# Altium project ESP32_USB_C.PrjPcb (part 2 of 3)
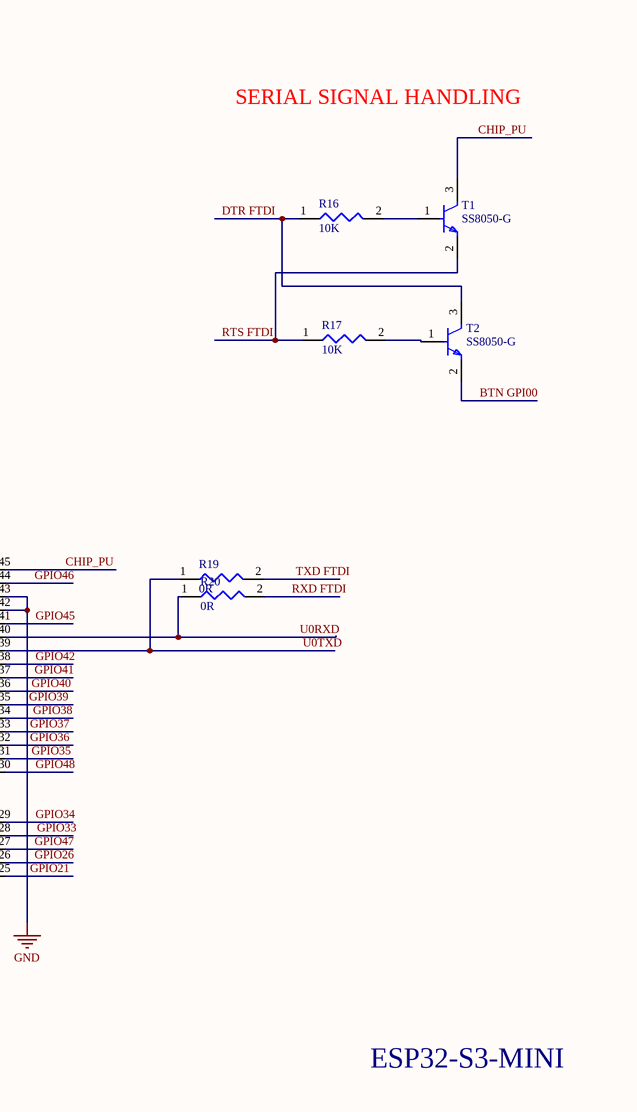
[diagram p4: ESP32_USB_C.SchDoc, bottom right]

## Sheet ESP32_USB_C.SchDoc (continued)
### Library data of the parts
C1 C8 = CC0402MRX5R6BB475: 10V 4.7uF X5R ±20% 0402 Multilayer Ceramic Capacitors MLCC - SMD/SMT ROHS; Manufacturer: Yageo Group; Value: 4.7µF; Temperature Coefficient: 30ppm/°C; Supplier: DigiKey; Supplier Part Number: 311-1734-1-ND; Manufacturer Part Number: CC0402MRX5R6BB475; RoHS: Compliant; Category: Ceramic Capacitors; Stock: 3327; Pricing: 1=0.1, 10=0.055, 50=0.038, 100=0.0328, 500=0.02396, 1000=0.02127, 2500=0.01843, 5000=0.01673 (USD); Case/Package: 0402; Case Code (Imperial): 0402; Case Code (Metric): 1005; China RoHS: Compliant; Country of Origin: Mainland China, Taiwan; Dielectric: X5R; Dielectric Material: Ceramic; Export Control Classification Number (ECCN) Code: EAR99; Halogen Free: Halogen Free; Height: 500µm; Harmonized Tariff Schedule (HTS) Code: 8532.24.00.20; Introduction Date: 2014-07-08; Lead Free: Lead Free; Length: 1mm; Lifecycle Status: Production; Material: Ceramic; Max Operating Temperature: 85°C; Min Operating Temperature: -55°C; Mounting Technology: Surface Mount; Number of Terminals: 2; Packaging: Tape & Reel (TR); REACH SVHC: Yes; Termination: SMD/SMT; Thickness: 558.8µm; Tolerance: 20%; Voltage Rating: 10V; Voltage Rating (DC): 10V; Weight: 652.039032µg; Width: 500µm; ComponentLink1URL: https://datasheet.octopart.com:443/CC0402MRX5R6BB475-Yageo-datasheet-170350636.pdf?src-supplier=IHS; ComponentLink1Description: https://datasheet.octopart.com:443/CC0402MRX5R6BB475-Yageo-datasheet-170350636.pdf?src-supplier=IHS; ComponentLink2URL: https://datasheet.octopart.com:443/CC0402MRX5R6BB475-Yageo-datasheet-78855684.pdf?src-supplier=Upverter; ComponentLink2Description: https://datasheet.octopart.com:443/CC0402MRX5R6BB475-Yageo-datasheet-78855684.pdf?src-supplier=Upverter; ComponentLink3URL: https://datasheet.octopart.com:443/CC0402MRX5R6BB475-Yageo-datasheet-140260304.pdf?src-supplier=Newark; ComponentLink3Description: https://datasheet.octopart.com:443/CC0402MRX5R6BB475-Yageo-datasheet-140260304.pdf?src-supplier=Newark; ComponentLink4URL: https://datasheet.octopart.com:443/CC0402MRX5R6BB475-Yageo-Group-datasheet-175963154.pdf?src-supplier=Newark; ComponentLink4Description: https://datasheet.octopart.com:443/CC0402MRX5R6BB475-Yageo-Group-datasheet-175963154.pdf?src-supplier=Newark; ComponentLink5URL: https://datasheet.octopart.com:443/CC0402MRX5R6BB475-Yageo-datasheet-158238148.pdf?src-supplier=Newark; ComponentLink5Description: https://datasheet.octopart.com:443/CC0402MRX5R6BB475-Yageo-datasheet-158238148.pdf?src-supplier=Newark; ComponentLink6URL: https://datasheet.octopart.com:443/CC0402MRX5R6BB475-Yageo-datasheet-182029487.pdf?src-supplier=Farnell; ComponentLink6Description: https://datasheet.octopart.com:443/CC0402MRX5R6BB475-Yageo-datasheet-182029487.pdf?src-supplier=Farnell; ComponentLink7URL: https://datasheet.octopart.com/CC0402MRX5R6BB475-Yageo-datasheet-86397281.pdf; ComponentLink7Description: https://datasheet.octopart.com/CC0402MRX5R6BB475-Yageo-datasheet-86397281.pdf; ComponentLink8URL: https://datasheet.octopart.com:443/CC0402MRX5R6BB475-Yageo-Group-datasheet-189192896.pdf?src-supplier=TME; ComponentLink8Description: https://datasheet.octopart.com:443/CC0402MRX5R6BB475-Yageo-Group-datasheet-189192896.pdf?src-supplier=TME; ComponentLink9URL: https://datasheet.octopart.com:443/CC0402MRX5R6BB475-Yageo-Group-datasheet-145016144.pdf?src-supplier=ODG+(Origin+Data+Global); ComponentLink9Description: https://datasheet.octopart.com:443/CC0402MRX5R6BB475-Yageo-Group-datasheet-145016144.pdf?src-supplier=ODG+(Origin+Data+Global); ComponentLink10URL: https://datasheet.octopart.com:443/CC0402MRX5R6BB475-Yageo-datasheet-137700085.pdf?src-supplier=Future+Electronics; ComponentLink10Description: https://datasheet.octopart.com:443/CC0402MRX5R6BB475-Yageo-datasheet-137700085.pdf?src-supplier=Future+Electronics; ComponentLink11URL: https://datasheet.octopart.com:443/CC0402MRX5R6BB475-Yageo-datasheet-78855687.pdf?src-supplier=Future+Electronics; ComponentLink11Description: https://datasheet.octopart.com:443/CC0402MRX5R6BB475-Yageo-datasheet-78855687.pdf?src-supplier=Future+Electronics; ComponentLink12URL: http://sigma.octopart.com:80/conflict_mineral_statement/Yageo-company-3.pdf?src-supplier=Compliance+Statements; ComponentLink12Description: http://sigma.octopart.com:80/conflict_mineral_statement/Yageo-company-3.pdf?src-supplier=Compliance+Statements; ComponentLink13URL: http://sigma.octopart.com:80/rohs_statement/Yageo-company-2.pdf?src-supplier=Compliance+Statements; ComponentLink13Description: http://sigma.octopart.com:80/rohs_statement/Yageo-company-2.pdf?src-supplier=Compliance+Statements
C2-C7 C12 = CL10E104KC8VPNC: Ceramic Capacitor, Multilayer, Ceramic, 100V, 10% +Tol, 10% -Tol, X8L, -40~+15% TC, 100nF, Surface Mount, 0603 inch; Manufacturer: Samsung Electro-Mechanics; Supplier: DigiKey; Supplier Part Number: 1276-CL10E104KC8VPNCDKR-ND; Manufacturer Part Number: CL10E104KC8VPNC; RoHS: Compliant; Category: Ceramic Capacitors; Stock: 438805; Pricing: 1=0.27, 10=0.155, 50=0.1122, 100=0.0989, 500=0.07654, 1000=0.06965 (USD); Value: 100nF; Case/Package: 0603; Dielectric Material: Ceramic; Height: 800µm; Length: 1.6mm; Lifecycle Status: Production; Max Operating Temperature: 150°C; Min Operating Temperature: -55°C; Mounting Technology: Surface Mount; Number of Terminals: 2; Ratings: AEC-Q200; REACH SVHC: Yes; Voltage Rating (DC): 100V; Width: 800µm
C9 = AC0612MRX7R9BB103: Surface Mount Ceramic Multilayer Capacitor Automotive Grade 0.01uF 20% X7R 50V 0612 Paper T/R; Manufacturer: Yageo Group; Value: 10nF; Number of Circuits: 4; Number of Elements: 1; Temperature Coefficient: 30ppm/°C; Supplier: DigiKey; Supplier Part Number: 13-AC0612MRX7R9BB103CT-ND; Manufacturer Part Number: AC0612MRX7R9BB103; RoHS: Compliant; Category: Capacitor Arrays; Stock: 4000; Pricing: 1=0.45, 10=0.272, 50=0.2022, 100=0.1808, 500=0.14454, 1000=0.13334 (USD); Case/Package: 0612; China RoHS: Non-Compliant; Country of Origin: Mainland China, Taiwan; Dielectric: X7R; Dielectric Material: Ceramic; Export Control Classification Number (ECCN) Code: EAR99; Height: 800µm; Height - Seated (Max): 800µm; Harmonized Tariff Schedule (HTS) Code: 8532.25.00.45; Introduction Date: 2017-01-16; Length: 3.2mm; Lifecycle Status: Production; Material: Ceramic; Max Operating Temperature: 125°C; Min Operating Temperature: -55°C; Mounting Technology: Surface Mount; Number of Terminals: 8; Ratings: AEC-Q200; REACH SVHC: Yes; Terminal Pitch: 800µm; Tolerance: 20%; Voltage Rating: 50V; Voltage Rating (DC): 50V; Width: 1.6mm; ComponentLink1URL: https://datasheet.octopart.com:443/AC0612MRX7R9BB103-Yageo-datasheet-170350635.pdf?src-supplier=IHS; ComponentLink1Description: https://datasheet.octopart.com:443/AC0612MRX7R9BB103-Yageo-datasheet-170350635.pdf?src-supplier=IHS; ComponentLink2URL: https://datasheet.octopart.com:443/AC0612MRX7R9BB103-Yageo-datasheet-130008987.pdf?src-supplier=Upverter; ComponentLink2Description: https://datasheet.octopart.com:443/AC0612MRX7R9BB103-Yageo-datasheet-130008987.pdf?src-supplier=Upverter; ComponentLink3URL: https://datasheet.octopart.com:443/AC0612MRX7R9BB103-Yageo-datasheet-182878021.pdf?src-supplier=Farnell; ComponentLink3Description: https://datasheet.octopart.com:443/AC0612MRX7R9BB103-Yageo-datasheet-182878021.pdf?src-supplier=Farnell; ComponentLink4URL: http://sigma.octopart.com:80/conflict_mineral_statement/Yageo-company-3.pdf?src-supplier=Compliance+Statements; ComponentLink4Description: http://sigma.octopart.com:80/conflict_mineral_statement/Yageo-company-3.pdf?src-supplier=Compliance+Statements; ComponentLink5URL: http://sigma.octopart.com:80/rohs_statement/Yageo-company-2.pdf?src-supplier=Compliance+Statements; ComponentLink5Description: http://sigma.octopart.com:80/rohs_statement/Yageo-company-2.pdf?src-supplier=Compliance+Statements
C10 = C0805C106K9RACTU: SMD Comm X7R 0805 (2012Metric) Ceramic Capacitor 0.079Lx0.049W 2.00mmx1.25mm X7R ±10% 10muF; Manufacturer: Yageo Group; Value: 10µF; Dissipation Factor: 7.5%; Voltage Rating: 6.3V; Supplier: DigiKey; Supplier Part Number: 399-C0805C106K9RACTUDKR-ND; Manufacturer Part Number: C0805C106K9RACTU; RoHS: Compliant; Category: Ceramic Capacitors; Stock: 33258; Pricing: 1=0.67, 10=0.417, 50=0.3166, 100=0.2858, 500=0.23376, 1000=0.21768 (USD); Case/Package: 0805; Case Code (Imperial): 0805; Case Code (Metric): 2012; China RoHS: Compliant; Country of Origin: Mexico; Depth: 1.25mm; Dielectric: X7R; Dielectric Material: Ceramic; Export Control Classification Number (ECCN) Code: EAR99; Height: 1.25mm; Harmonized Tariff Schedule (HTS) Code: 8532.24.00.20; Introduction Date: 2012-05-22; Length: 2mm; Lifecycle Status: Production; Material: Ceramic; Max Operating Temperature: 125°C; Manufacturer Package Identifier: 0805 (2012 metric); Min Operating Temperature: -55°C; Mounting Technology: Surface Mount; Number of Terminals: 2; Packaging: Cut Tape; REACH SVHC: Yes; Schedule B: 8532240020, 8532240020|8532240020|8532240020|8532240020|8532240020; Termination: SMD/SMT; Thickness: 1.397mm; Tolerance: 10%; Voltage Rating (DC): 6.3V; Width: 1.25mm; ComponentLink1URL: https://datasheet.octopart.com:443/C0805C106K9RACTU-KEMET-datasheet-178445679.pdf?src-supplier=IHS; ComponentLink1Description: https://datasheet.octopart.com:443/C0805C106K9RACTU-KEMET-datasheet-178445679.pdf?src-supplier=IHS; ComponentLink2URL: https://datasheet.octopart.com:443/C0805C106K9RAC7800-KEMET-datasheet-184793276.pdf?src-supplier=IHS; ComponentLink2Description: https://datasheet.octopart.com:443/C0805C106K9RAC7800-KEMET-datasheet-184793276.pdf?src-supplier=IHS; ComponentLink3URL: https://datasheet.octopart.com:443/C0805C106K9RACTU-KEMET-datasheet-137357759.pdf?src-supplier=Farnell; ComponentLink3Description: https://datasheet.octopart.com:443/C0805C106K9RACTU-KEMET-datasheet-137357759.pdf?src-supplier=Farnell; ComponentLink4URL: https://datasheet.octopart.com:443/C0805C106K9RACTU-KEMET-datasheet-100448665.pdf?src-supplier=Farnell; ComponentLink4Description: https://datasheet.octopart.com:443/C0805C106K9RACTU-KEMET-datasheet-100448665.pdf?src-supplier=Farnell; ComponentLink5URL: https://datasheet.octopart.com:443/C0805C106K9RACTU-KEMET-datasheet-74831648.pdf?src-supplier=Farnell; ComponentLink5Description: https://datasheet.octopart.com:443/C0805C106K9RACTU-KEMET-datasheet-74831648.pdf?src-supplier=Farnell; ComponentLink6URL: https://datasheet.octopart.com:443/C0805C106K9RACTU-Kemet-datasheet-66076756.pdf?src-supplier=element14+APAC; ComponentLink6Description: https://datasheet.octopart.com:443/C0805C106K9RACTU-Kemet-datasheet-66076756.pdf?src-supplier=element14+APAC; ComponentLink7URL: https://datasheet.octopart.com:443/C0805C106K9RACTU-Kemet-datasheet-62058920.pdf?src-supplier=element14+APAC; ComponentLink7Description: https://datasheet.octopart.com:443/C0805C106K9RACTU-Kemet-datasheet-62058920.pdf?src-supplier=element14+APAC; ComponentLink8URL: https://datasheet.octopart.com:443/C0805C106K9RACTU-KEMET-datasheet-68331906.pdf?src-supplier=element14+APAC; ComponentLink8Description: https://datasheet.octopart.com:443/C0805C106K9RACTU-KEMET-datasheet-68331906.pdf?src-supplier=element14+APAC; ComponentLink9URL: https://datasheet.octopart.com:443/C0805C106K9RACTU-KEMET-datasheet-176289605.pdf?src-supplier=Newark; ComponentLink9Description: https://datasheet.octopart.com:443/C0805C106K9RACTU-KEMET-datasheet-176289605.pdf?src-supplier=Newark; ComponentLink10URL: https://datasheet.octopart.com:443/C0805C106K9RACTU-KEMET-datasheet-130256537.pdf?src-supplier=Newark; ComponentLink10Description: https://datasheet.octopart.com:443/C0805C106K9RACTU-KEMET-datasheet-130256537.pdf?src-supplier=Newark; ComponentLink11URL: https://datasheet.octopart.com:443/C0805C106K9RACTU-Kemet-datasheet-21527579.pdf?src-supplier=Newark; ComponentLink11Description: https://datasheet.octopart.com:443/C0805C106K9RACTU-Kemet-datasheet-21527579.pdf?src-supplier=Newark; ComponentLink12URL: https://datasheet.octopart.com:443/C0805C106K9RACTU-Kemet-datasheet-17019117.pdf?src-supplier=Newark; ComponentLink12Description: https://datasheet.octopart.com:443/C0805C106K9RACTU-Kemet-datasheet-17019117.pdf?src-supplier=Newark; ComponentLink13URL: https://datasheet.octopart.com:443/C0805C106K9RACTU-KEMET-datasheet-157246124.pdf?src-supplier=TME; ComponentLink13Description: https://datasheet.octopart.com:443/C0805C106K9RACTU-KEMET-datasheet-157246124.pdf?src-supplier=TME; ComponentLink14URL: https://datasheet.octopart.com/C0805C106K9RACTU-KEMET-datasheet-84169754.pdf; ComponentLink14Description: https://datasheet.octopart.com/C0805C106K9RACTU-KEMET-datasheet-84169754.pdf
C11 C14 = CL05A105KO5NNNC: 16V 1uF X5R 卤10% 0402 Multilayer Ceramic Capacitors MLCC - SMD/SMT ROHS; Manufacturer: Samsung Electro-Mechanics; Value: 1µF; Tolerance: 10%; Supplier: DigiKey; Supplier Part Number: 1276-1067-2-ND; Manufacturer Part Number: CL05A105KO5NNNC; RoHS: Compliant; Category: Ceramic Capacitors; Stock: 6622206; Pricing: 10000=0.00891, 20000=0.00815, 30000=0.00777, 50000=0.00734, 70000=0.0071, 100000=0.00686 (USD); Case/Package: 0402; Case Code (Imperial): 0402; Case Code (Metric): 1005; China RoHS: Compliant; Contact Plating: Tin; Depth: 500µm; Dielectric: X5R; Dielectric Material: Ceramic; Height: 550µm; Length: 1mm; Lifecycle Status: Production; Material: Ceramic; Max Operating Temperature: 85°C; Min Operating Temperature: -55°C; Mounting Technology: Surface Mount; Number of Terminals: 2; Radiation Hardening: No; REACH SVHC: Yes; Schedule B: 8532240020, 8532240020|8532240020, 8532240020|8532240020|8532240020, 8532240020|8532240020|8532240020|8532240020; Thickness: 558.8µm; Voltage: 16V; Voltage Rating: 16V; Voltage Rating (DC): 16V; Width: 500µm; ComponentLink1URL: https://datasheet.octopart.com:443/CL05A105KO5NNNC-Samsung-Electro-Mechanics-datasheet-181960514.pdf?src-supplier=IHS; ComponentLink1Description: https://datasheet.octopart.com:443/CL05A105KO5NNNC-Samsung-Electro-Mechanics-datasheet-181960514.pdf?src-supplier=IHS; ComponentLink2URL: https://datasheet.octopart.com:443/CL05A105KO5NNNC-Samsung-Electro-Mechanics-datasheet-136031720.pdf?src-supplier=Samsung+SCT; ComponentLink2Description: https://datasheet.octopart.com:443/CL05A105KO5NNNC-Samsung-Electro-Mechanics-datasheet-136031720.pdf?src-supplier=Samsung+SCT; ComponentLink3URL: https://datasheet.octopart.com:443/CL05A105KO5NNNC-Samsung-Electro-Mechanics-datasheet-11776774.pdf?src-supplier=Future+Electronics; ComponentLink3Description: https://datasheet.octopart.com:443/CL05A105KO5NNNC-Samsung-Electro-Mechanics-datasheet-11776774.pdf?src-supplier=Future+Electronics; ComponentLink4URL: https://datasheet.octopart.com:443/CL05A105KO5NNNC-Samsung-Electro-Mechanics-datasheet-110226202.pdf?src-supplier=Future+Electronics; ComponentLink4Description: https://datasheet.octopart.com:443/CL05A105KO5NNNC-Samsung-Electro-Mechanics-datasheet-110226202.pdf?src-supplier=Future+Electronics; ComponentLink5URL: https://datasheet.octopart.com:443/CL05A105KO5NNNC-Samsung-Electro-Mechanics-datasheet-81461590.pdf?src-supplier=Future+Electronics; ComponentLink5Description: https://datasheet.octopart.com:443/CL05A105KO5NNNC-Samsung-Electro-Mechanics-datasheet-81461590.pdf?src-supplier=Future+Electronics; ComponentLink6URL: https://datasheet.octopart.com:443/CL05A105KO5NNNC-Samsung-datasheet-42280519.pdf?src-supplier=Future+Electronics; ComponentLink6Description: https://datasheet.octopart.com:443/CL05A105KO5NNNC-Samsung-datasheet-42280519.pdf?src-supplier=Future+Electronics; ComponentLink7URL: https://datasheet.octopart.com:443/CL05A105KO5NNNC-Samsung-datasheet-34152987.pdf?src-supplier=Future+Electronics; ComponentLink7Description: https://datasheet.octopart.com:443/CL05A105KO5NNNC-Samsung-datasheet-34152987.pdf?src-supplier=Future+Electronics; ComponentLink8URL: https://datasheet.octopart.com:443/CL05A105KO5NNNC-Samsung-datasheet-8329584.pdf?src-supplier=Future+Electronics; ComponentLink8Description: https://datasheet.octopart.com:443/CL05A105KO5NNNC-Samsung-datasheet-8329584.pdf?src-supplier=Future+Electronics; ComponentLink9URL: https://datasheet.octopart.com:443/CL05A105KO5NNNC-Samsung-Electro-Mechanics-datasheet-149136633.pdf?src-supplier=Future+Electronics; ComponentLink9Description: https://datasheet.octopart.com:443/CL05A105KO5NNNC-Samsung-Electro-Mechanics-datasheet-149136633.pdf?src-supplier=Future+Electronics; ComponentLink10URL: https://datasheet.octopart.com/CL05A105KO5NNNC-Samsung-Electro-Mechanics-datasheet-97040617.pdf; ComponentLink10Description: https://datasheet.octopart.com/CL05A105KO5NNNC-Samsung-Electro-Mechanics-datasheet-97040617.pdf; ComponentLink11URL: https://datasheet.octopart.com/CL05A105KO5NNNC-Samsung-Electro-Mechanics-datasheet-8324245.pdf; ComponentLink11Description: https://datasheet.octopart.com/CL05A105KO5NNNC-Samsung-Electro-Mechanics-datasheet-8324245.pdf; ComponentLink12URL: https://datasheet.octopart.com:443/CL05A105KO5NNNC-Samsung-datasheet-59220082.pdf?src-supplier=TME; ComponentLink12Description: https://datasheet.octopart.com:443/CL05A105KO5NNNC-Samsung-datasheet-59220082.pdf?src-supplier=TME
C13 = CL05A106MP8NUB8: 10V 10uF X5R 卤20% 0402 Multilayer Ceramic Capacitors MLCC - SMD/SMT ROHS; Manufacturer: Samsung Electro-Mechanics; Value: 10µF; Tolerance: 20%; Supplier: DigiKey; Supplier Part Number: 1276-6830-1-ND; Manufacturer Part Number: CL05A106MP8NUB8; RoHS: Compliant; Category: Ceramic Capacitors; Stock: 1423154; Pricing: 1=0.35, 10=0.209, 50=0.153, 100=0.1358, 500=0.1069, 1000=0.09798, 2500=0.08857 (USD); Case/Package: 0402; Case Code (Imperial): 0402; Case Code (Metric): 1005; China RoHS: Compliant; Country of Origin: Mainland China, Philippines, South Korea; Dielectric Material: Ceramic; Export Control Classification Number (ECCN) Code: EAR99; Height: 800µm; Harmonized Tariff Schedule (HTS) Code: 8532.24.00.20; Introduction Date: 2014-02-27; Length: 1mm; Lifecycle Status: Production; Material: Ceramic; Max Operating Temperature: 85°C; Min Operating Temperature: -55°C; Mounting Technology: Surface Mount; Number of Terminals: 2; REACH SVHC: Yes; Schedule B: 8532240020, 8532240020|8532240020, 8532240020|8532240020|8532240020, 8532240020|8532240020|8532240020|8532240020; Thickness: 889µm; Voltage Rating: 10V; Voltage Rating (DC): 10V; Width: 500µm; ComponentLink1URL: https://datasheet.octopart.com:443/CL05A106MP8NUB8-Samsung-Electro-Mechanics-datasheet-136460857.pdf?src-supplier=IHS; ComponentLink1Description: https://datasheet.octopart.com:443/CL05A106MP8NUB8-Samsung-Electro-Mechanics-datasheet-136460857.pdf?src-supplier=IHS; ComponentLink2URL: https://datasheet.octopart.com:443/CL05A106MP8NUB8-Samsung-Electro-Mechanics-datasheet-181551178.pdf?src-supplier=Newark; ComponentLink2Description: https://datasheet.octopart.com:443/CL05A106MP8NUB8-Samsung-Electro-Mechanics-datasheet-181551178.pdf?src-supplier=Newark; ComponentLink3URL: https://datasheet.octopart.com:443/CL05A106MP8NUB8-Samsung-Electro-Mechanics-datasheet-136031724.pdf?src-supplier=Newark; ComponentLink3Description: https://datasheet.octopart.com:443/CL05A106MP8NUB8-Samsung-Electro-Mechanics-datasheet-136031724.pdf?src-supplier=Newark; ComponentLink4URL: https://datasheet.octopart.com:443/CL05A106MP8NUB8-Samsung-Electro-Mechanics-datasheet-141346815.pdf?src-supplier=Samsung+SCT; ComponentLink4Description: https://datasheet.octopart.com:443/CL05A106MP8NUB8-Samsung-Electro-Mechanics-datasheet-141346815.pdf?src-supplier=Samsung+SCT; ComponentLink5URL: https://datasheet.octopart.com:443/CL05A106MP8NUB8-Samsung-Electro-Mechanics-datasheet-110326781.pdf?src-supplier=Future+Electronics; ComponentLink5Description: https://datasheet.octopart.com:443/CL05A106MP8NUB8-Samsung-Electro-Mechanics-datasheet-110326781.pdf?src-supplier=Future+Electronics; ComponentLink6URL: https://datasheet.octopart.com:443/CL05A106MP8NUB8-Samsung-Electro-Mechanics-datasheet-96443587.pdf?src-supplier=Future+Electronics; ComponentLink6Description: https://datasheet.octopart.com:443/CL05A106MP8NUB8-Samsung-Electro-Mechanics-datasheet-96443587.pdf?src-supplier=Future+Electronics; ComponentLink7URL: https://datasheet.octopart.com:443/CL05A106MP8NUB8-Samsung-Electro-Mechanics-datasheet-68297032.pdf?src-supplier=Future+Electronics; ComponentLink7Description: https://datasheet.octopart.com:443/CL05A106MP8NUB8-Samsung-Electro-Mechanics-datasheet-68297032.pdf?src-supplier=Future+Electronics; ComponentLink8URL: https://datasheet.octopart.com:443/CL05A106MP8NUB8-Samsung-Electro-Mechanics-datasheet-86032222.pdf?src-supplier=Future+Electronics; ComponentLink8Description: https://datasheet.octopart.com:443/CL05A106MP8NUB8-Samsung-Electro-Mechanics-datasheet-86032222.pdf?src-supplier=Future+Electronics
D1 = APHCM2012CGCK-F01: LED GREEN CLEAR CHIP SMD / Green 570nm LED Indication - Discrete 2.1V 0805 (2012 Metric); Manufacturer: Kingbright; Forward Current: 30mA; Lens Style: Clear, Flat; Luminous Intensity: 40mcd; Max Junction Temperature (Tj): 115°C; Number of Circuits: 1; Peak Wavelength: 574nm; Power Dissipation: 75mW; Reverse Voltage: 5V; Shape: Rectangular; Test Current: 20mA; Viewing Angle: 110°; Supplier: DigiKey; Supplier Part Number: 754-1094-1-ND; Manufacturer Part Number: APHCM2012CGCK-F01; RoHS: Compliant; Category: LEDs; Stock: 7334; Pricing: 1=0.23, 10=0.155, 100=0.1081, 500=0.08668, 1000=0.07958 (USD); Case/Package: 0805; Case Code (Imperial): 0805; Case Code (Metric): 2012; China RoHS: Compliant; Color: Green; Country of Origin: Mainland China; Dominant Wavelength: 570nm; Forward Voltage: 2.1V; Height: 400µm; Harmonized Tariff Schedule (HTS) Code: 8541.40.20.00; Illumination Color: Green; Introduction Date: 2005-03-30; Lead Free: Lead Free; Length: 2mm; Lens Color: Clear; Lifecycle Status: Production; Max Operating Temperature: 85°C; Manufacturer Package Identifier: 0805 (2012 metric); Min Operating Temperature: -40°C; Mounting Technology: Surface Mount; Number of LEDs: 1; Pins: 2; Number of Terminals: 2; Packaging: Digi-Reel®; REACH SVHC: Yes; Schedule B: 8541402000, 8541402000|8541402000, 8541402000|8541402000|8541402000, 8541402000|8541402000|8541402000|8541402000; Terminal Pitch: 2.1mm; Wavelength: 570nm; Width: 1.25mm; ComponentLink1URL: https://datasheet.octopart.com:443/APHCM2012CGCK-F01-Kingbright-datasheet-151610464.pdf?src-supplier=IHS; ComponentLink1Description: https://datasheet.octopart.com:443/APHCM2012CGCK-F01-Kingbright-datasheet-151610464.pdf?src-supplier=IHS; ComponentLink2URL: https://datasheet.octopart.com:443/APHCM2012CGCK-F01-Kingbright-datasheet-158235.pdf?src-supplier=IHS; ComponentLink2Description: https://datasheet.octopart.com:443/APHCM2012CGCK-F01-Kingbright-datasheet-158235.pdf?src-supplier=IHS; ComponentLink3URL: https://datasheet.octopart.com:443/APHCM2012CGCK-F01-Kingbright-datasheet-12510959.pdf?src-supplier=Sager+Electronics; ComponentLink3Description: https://datasheet.octopart.com:443/APHCM2012CGCK-F01-Kingbright-datasheet-12510959.pdf?src-supplier=Sager+Electronics; ComponentLink4URL: https://datasheet.octopart.com:443/APHCM2012CGCK-F01-Kingbright-datasheet-150021452.pdf?src-supplier=Sager+Electronics; ComponentLink4Description: https://datasheet.octopart.com:443/APHCM2012CGCK-F01-Kingbright-datasheet-150021452.pdf?src-supplier=Sager+Electronics; ComponentLink5URL: https://datasheet.octopart.com:443/APHCM2012CGCK-F01-Kingbright-datasheet-9635685.pdf?src-supplier=RS+(Formerly+Allied+Electronics); ComponentLink5Description: https://datasheet.octopart.com:443/APHCM2012CGCK-F01-Kingbright-datasheet-9635685.pdf?src-supplier=RS+(Formerly+Allied+Electronics)
D2 = CMD17-21VRD/TR8: CML CMD17-21VRD/TR8 LED SMT 0805 2.0V 6mcd 140deg Red 3K Part of the VCC Family of Products; Forward Current: 30mA; Forward Voltage: 2.8V; Lens Style: Colored, Diffused, Rectangular, Tinted; Luminous Intensity: 3mcd; Number of Circuits: 1; Peak Wavelength: 640nm; Power Rating: 100mW; Reverse Voltage: 5V; Shape: Rectangular; Test Current: 20mA; Viewing Angle: 140°; Supplier: DigiKey; Supplier Part Number: L62501DKR-ND; Manufacturer: VCC; Manufacturer Part Number: CMD17-21VRD/TR8; RoHS: Compliant; Category: LEDs; Stock: 24290; Pricing: 1=0.74, 10=0.511, 100=0.3715, 500=0.30926, 1000=0.28883, 2000=0.27148 (USD); Case/Package: 0805; Case Code (Imperial): 0805; Case Code (Metric): 2012; Color: Red; Country of Origin: Mainland China; Export Control Classification Number (ECCN) Code: EAR99; Height: 1.1mm; Harmonized Tariff Schedule (HTS) Code: 8541.40.20.00; Illumination Color: Red; Introduction Date: 2002-01-15; Lead Free: Lead Free; Length: 2mm; Lens Color: Red; Lifecycle Status: Production; Max Operating Temperature: 85°C; Min Operating Temperature: -40°C; Mounting Technology: Surface Mount; Number of LEDs: 1; Pins: 2; Number of Terminals: 2; Packaging: Tape and Reel; REACH SVHC: Yes; Reverse Voltage (DC): 5V; Schedule B: 8541402000, 8541402000|8541402000|8541402000|8541402000|8541402000; Terminal Pitch: 1.6mm; Wavelength: 640nm; Width: 1.25mm; ComponentLink1URL: https://datasheet.octopart.com:443/CMD17-21VRD-TR8-Visual-Communications-datasheet-86420146.pdf?src-supplier=RS+(Formerly+Allied+Electronics); ComponentLink1Description: https://datasheet.octopart.com:443/CMD17-21VRD-TR8-Visual-Communications-datasheet-86420146.pdf?src-supplier=RS+(Formerly+Allied+Electronics); ComponentLink2URL: https://datasheet.octopart.com:443/CMD17-21VRD-TR8-Visual-Communications-datasheet-62311551.pdf?src-supplier=RS+(Formerly+Allied+Electronics); ComponentLink2Description: https://datasheet.octopart.com:443/CMD17-21VRD-TR8-Visual-Communications-datasheet-62311551.pdf?src-supplier=RS+(Formerly+Allied+Electronics); ComponentLink3URL: https://datasheet.octopart.com:443/CMD17-21VRD-TR8-VCC-datasheet-158457.pdf?src-supplier=IHS; ComponentLink3Description: https://datasheet.octopart.com:443/CMD17-21VRD-TR8-VCC-datasheet-158457.pdf?src-supplier=IHS; ComponentLink4URL: https://datasheet.octopart.com:443/CMD17-21VRD-TR8-Visual-Communications-datasheet-67475886.pdf?src-supplier=element14+APAC; ComponentLink4Description: https://datasheet.octopart.com:443/CMD17-21VRD-TR8-Visual-Communications-datasheet-67475886.pdf?src-supplier=element14+APAC; ComponentLink5URL: https://datasheet.octopart.com:443/CMD17-21VRD-TR8-Chicago-Miniature-Lighting-datasheet-22094594.pdf?src-supplier=Newark; ComponentLink5Description: https://datasheet.octopart.com:443/CMD17-21VRD-TR8-Chicago-Miniature-Lighting-datasheet-22094594.pdf?src-supplier=Newark; ComponentLink6URL: https://datasheet.octopart.com:443/CMD17-21VRD-TR8-Visual-Communications-datasheet-8816892.pdf?src-supplier=Newark; ComponentLink6Description: https://datasheet.octopart.com:443/CMD17-21VRD-TR8-Visual-Communications-datasheet-8816892.pdf?src-supplier=Newark
J1 J2 = 22-28-4245: Conn Unshrouded Header HDR 24 POS 2.54mm Solder ST Thru-Hole KK® Bag; Manufacturer: Molex; Manufacturer Lifecycle Status: ACTIVE; Contact Resistance: 20mΩ; Current Rating: 4A; Gender: Male; Insulation Resistance: 50GΩ; Number of Circuits: 24; Plating: Tin; Plating Thickness: 381nm; Ratings: CSA; Supplier: DigiKey; Supplier Part Number: 900-0022284245-ND; Manufacturer Part Number: 22-28-4245; RoHS: Compliant; Category: Headers and Wire Housings; Stock: 579; Pricing: 1=3.81, 10=3.237, 100=2.7512, 500=2.45582, 1000=2.33866 (USD); China RoHS: Compliant; Color: Black; Contact Material: Brass; Contact Plating: Gold; Country of Origin: US; Export Control Classification Number (ECCN) Code: EAR99; Housing Color: Black; Harmonized Tariff Schedule (HTS) Code: 8536.69.40.40; Introduction Date: 1994-12-01; Lead Free: Lead Free; Lifecycle Status: Production; Max Operating Temperature: 75°C; Min Operating Temperature: -40°C; Mounting Technology: Through Hole; Number of Contacts: 24; Pins: 24; Number of Positions: 24; Number of Rows: 1; Orientation: Vertical; Packaging: Bulk; Pitch: 2.54mm; REACH SVHC: Yes; Schedule B: 8536694040, 8536694040|8536694040|8536694040|8536694040|8536694040; Terminal Pitch: 2.54mm; Termination: Solder; ComponentLink1URL: https://datasheet.octopart.com:443/22-28-4245-Molex-datasheet-166051265.pdf?src-supplier=IHS; ComponentLink1Description: https://datasheet.octopart.com:443/22-28-4245-Molex-datasheet-166051265.pdf?src-supplier=IHS; ComponentLink2URL: https://datasheet.octopart.com:443/022284245-Molex-datasheet-8337137.pdf?src-supplier=Arrow+Electronics; ComponentLink2Description: https://datasheet.octopart.com:443/022284245-Molex-datasheet-8337137.pdf?src-supplier=Arrow+Electronics; ComponentLink3URL: https://datasheet.octopart.com:443/22-28-4245-Molex-datasheet-16300812.pdf?src-supplier=Molex; ComponentLink3Description: https://datasheet.octopart.com:443/22-28-4245-Molex-datasheet-16300812.pdf?src-supplier=Molex; ComponentLink4URL: https://sigma.octopart.com:443/16300370/technical_drawing/Molex-22-28-4245.pdf?src-supplier=Molex; ComponentLink4Description: https://sigma.octopart.com:443/16300370/technical_drawing/Molex-22-28-4245.pdf?src-supplier=Molex; ComponentLink5URL: https://datasheet.octopart.com:443/22-28-4245-Molex-datasheet-4210.pdf?src-supplier=DigiKey; ComponentLink5Description: https://datasheet.octopart.com:443/22-28-4245-Molex-datasheet-4210.pdf?src-supplier=DigiKey; ComponentLink6URL: http://sigma.octopart.com:80/16300813/rohs_statement/Molex-22-28-4245.pdf?src-supplier=Compliance+Statements; ComponentLink6Description: http://sigma.octopart.com:80/16300813/rohs_statement/Molex-22-28-4245.pdf?src-supplier=Compliance+Statements; ComponentLink7URL: http://sigma.octopart.com:80/reach_statement/Molex-company-74.pdf?src-supplier=Compliance+Statements; ComponentLink7Description: http://sigma.octopart.com:80/reach_statement/Molex-company-74.pdf?src-supplier=Compliance+Statements; ComponentLink8URL: http://sigma.octopart.com:80/rohs_statement/Molex-company-73.pdf?src-supplier=Compliance+Statements; ComponentLink8Description: http://sigma.octopart.com:80/rohs_statement/Molex-company-73.pdf?src-supplier=Compliance+Statements; ComponentLink9URL: http://sigma.octopart.com:80/conflict_mineral_statement/Molex-company-72.pdf?src-supplier=Compliance+Statements; ComponentLink9Description: http://sigma.octopart.com:80/conflict_mineral_statement/Molex-company-72.pdf?src-supplier=Compliance+Statements
J3 J4 = 217179-0001: USB Connector, 16 Contact(s), Female, Right Angle, Surface Mount Terminal, Locking, Receptacle; Manufacturer: Molex; Contact Resistance: 50mΩ; Current Rating: 1.25A; Dielectric Material: Polyamide; Insulation Resistance: 100MΩ; Number of Contacts: 16; Number of Ports: 1; USB Standard: USB 2.0; Voltage Rating: 30V; Supplier: DigiKey; Supplier Part Number: 900-2171790001CT-ND; Manufacturer Part Number: 217179-0001; RoHS: Compliant; Category: USB Connectors; Stock: 65324; Pricing: 1=0.83, 10=0.704, 25=0.6596, 50=0.628, 100=0.598, 250=0.56052, 500=0.53374 (USD); China RoHS: Compliant; Contact Material: Gold, Nickel; Country of Origin: Mainland China; Export Control Classification Number (ECCN) Code: EAR99; Gender: Female; Height: 3.36mm; Harmonized Tariff Schedule (HTS) Code: 8536.69.40.30; Insulation Color: Black; Introduction Date: 2021-08-30; Lifecycle Status: Production; Max Operating Temperature: 85°C; Min Operating Temperature: -40°C; Number of Positions: 16; Number of Rows: 1; Orientation: Right Angle; REACH SVHC: Yes; Shell Finish: Nickel; Shell Material: Stainless Steel; Terminal Pitch: 500µm; ComponentLink1URL: https://datasheet.octopart.com:443/217179-0001-Molex-datasheet-158871109.pdf?src-supplier=ODG+(Origin+Data+Global); ComponentLink1Description: https://datasheet.octopart.com:443/217179-0001-Molex-datasheet-158871109.pdf?src-supplier=ODG+(Origin+Data+Global); ComponentLink2URL: https://sigma.octopart.com:443/158871110/technical_drawing/Molex-217179-0001.pdf?src-supplier=Upverter; ComponentLink2Description: https://sigma.octopart.com:443/158871110/technical_drawing/Molex-217179-0001.pdf?src-supplier=Upverter; ComponentLink3URL: https://datasheet.octopart.com:443/217179-0001-Molex-datasheet-164573281.pdf?src-supplier=RS+(Formerly+Allied+Electronics); ComponentLink3Description: https://datasheet.octopart.com:443/217179-0001-Molex-datasheet-164573281.pdf?src-supplier=RS+(Formerly+Allied+Electronics); ComponentLink4URL: http://sigma.octopart.com:80/reach_statement/Molex-company-74.pdf?src-supplier=Compliance+Statements; ComponentLink4Description: http://sigma.octopart.com:80/reach_statement/Molex-company-74.pdf?src-supplier=Compliance+Statements; ComponentLink5URL: http://sigma.octopart.com:80/rohs_statement/Molex-company-73.pdf?src-supplier=Compliance+Statements; ComponentLink5Description: http://sigma.octopart.com:80/rohs_statement/Molex-company-73.pdf?src-supplier=Compliance+Statements; ComponentLink6URL: http://sigma.octopart.com:80/conflict_mineral_statement/Molex-company-72.pdf?src-supplier=Compliance+Statements; ComponentLink6Description: http://sigma.octopart.com:80/conflict_mineral_statement/Molex-company-72.pdf?src-supplier=Compliance+Statements
J5-J7 J10-J12 = AQ3045-01ETG: TVS DIODE 12VC 3A SOD882 / ESD Suppressor TVS Bi-Dir 5.3V Automotive 2-Pin SOD-882 T/R; Manufacturer: Littelfuse; Breakdown Voltage: 7.8V; Clamping Voltage: 12V; Leakage Current: 100nA; Max Breakdown Voltage: 9V; Min Breakdown Voltage: 6.8V; Number of Channels: 1; Peak Pulse Power: 40W; Polarity: Bidirectional; Supplier: DigiKey; Supplier Part Number: F9321DKR-ND; Manufacturer Part Number: AQ3045-01ETG; RoHS: Compliant; Category: TVS Diodes; Stock: 8433; Pricing: 1=0.71, 10=0.44, 100=0.2817, 500=0.21354, 1000=0.19154, 2000=0.17301, 5000=0.15294 (USD); Lifecycle Status: Production; Max Operating Temperature: 150°C; Min Operating Temperature: -40°C; Mounting Technology: Surface Mount; Number of Elements: 1; Number of Terminals: 2; Operating Supply Voltage: 5.3V; Packaging: Cut Tape; Peak Reverse Current: 100nA; Ratings: AEC-Q101; REACH SVHC: Yes; Reverse Standoff Voltage: 5.3V; ComponentLink1URL: https://datasheet.octopart.com:443/AQ3045-01ETG-Littelfuse-datasheet-180606588.pdf?src-supplier=IHS; ComponentLink1Description: https://datasheet.octopart.com:443/AQ3045-01ETG-Littelfuse-datasheet-180606588.pdf?src-supplier=IHS; ComponentLink2URL: https://datasheet.octopart.com:443/AQ3045-01ETG-Littelfuse-datasheet-140480283.pdf?src-supplier=ODG+(Origin+Data+Global); ComponentLink2Description: https://datasheet.octopart.com:443/AQ3045-01ETG-Littelfuse-datasheet-140480283.pdf?src-supplier=ODG+(Origin+Data+Global); ComponentLink3URL: https://datasheet.octopart.com:443/AQ3045-01ETG-Littelfuse-datasheet-101609968.pdf?src-supplier=Farnell; ComponentLink3Description: https://datasheet.octopart.com:443/AQ3045-01ETG-Littelfuse-datasheet-101609968.pdf?src-supplier=Farnell; ComponentLink4URL: https://datasheet.octopart.com:443/AQ3045-01ETG-Littelfuse-datasheet-183003566.pdf?src-supplier=JRH+Electronics; ComponentLink4Description: https://datasheet.octopart.com:443/AQ3045-01ETG-Littelfuse-datasheet-183003566.pdf?src-supplier=JRH+Electronics; ComponentLink5URL: https://datasheet.octopart.com:443/AQ3045-01ETG-Littelfuse-datasheet-170904929.pdf?src-supplier=Future+Electronics; ComponentLink5Description: https://datasheet.octopart.com:443/AQ3045-01ETG-Littelfuse-datasheet-170904929.pdf?src-supplier=Future+Electronics
J8 = FTS-103-01-F-S: Pin Header, Board-to-Board, Wire-to-Board, 3.4 A, 1.27 mm, 1 Rows, 3 Contacts, Through Hole; Manufacturer: Samtec; Manufacturer Lifecycle Status: PRODUCTION; Gender: Male; Number of Contacts: 3; Pitch: 1.27mm; Supplier: DigiKey; Supplier Part Number: 612-FTS-103-01-F-S-ND; Manufacturer Part Number: FTS-103-01-F-S; RoHS: Compliant; Category: Board to Board Connectors; Stock: 835; Pricing: 1=0.73, 50=0.638, 100=0.541, 500=0.449, 1000=0.384, 2000=0.314, 5000=0.295 (USD); Contact Plating: Gold; Lifecycle Status: Production; Mounting Technology: Through Hole; Number of Rows: 1; Packaging: Bulk; Radiation Hardening: No; Termination: Solder; ComponentLink1URL: https://datasheet.octopart.com:443/FTS-103-01-F-S-Samtec-datasheet-97029283.pdf?src-supplier=Newark; ComponentLink1Description: https://datasheet.octopart.com:443/FTS-103-01-F-S-Samtec-datasheet-97029283.pdf?src-supplier=Newark; ComponentLink2URL: https://datasheet.octopart.com:443/FTS-103-01-F-S-Samtec-datasheet-165596534.pdf?src-supplier=Newark; ComponentLink2Description: https://datasheet.octopart.com:443/FTS-103-01-F-S-Samtec-datasheet-165596534.pdf?src-supplier=Newark; ComponentLink3URL: https://sigma.octopart.com:443/97029285/technical_drawing/Samtec-FTS-103-01-F-S.pdf?src-supplier=element14+APAC; ComponentLink3Description: https://sigma.octopart.com:443/97029285/technical_drawing/Samtec-FTS-103-01-F-S.pdf?src-supplier=element14+APAC; ComponentLink4URL: https://datasheet.octopart.com:443/FTS-103-01-F-S-Samtec-datasheet-118493358.pdf?src-supplier=Electro+Sonic; ComponentLink4Description: https://datasheet.octopart.com:443/FTS-103-01-F-S-Samtec-datasheet-118493358.pdf?src-supplier=Electro+Sonic; ComponentLink5URL: https://datasheet.octopart.com:443/FTS-103-01-F-S-Samtec-datasheet-176663378.pdf?src-supplier=Toby+Electronics; ComponentLink5Description: https://datasheet.octopart.com:443/FTS-103-01-F-S-Samtec-datasheet-176663378.pdf?src-supplier=Toby+Electronics; ComponentLink6URL: https://datasheet.octopart.com:443/FTS-103-01-F-S-Samtec-datasheet-116535195.pdf?src-supplier=Toby+Electronics; ComponentLink6Description: https://datasheet.octopart.com:443/FTS-103-01-F-S-Samtec-datasheet-116535195.pdf?src-supplier=Toby+Electronics; ComponentLink7URL: https://datasheet.octopart.com:443/FTS-103-01-F-S-Samtec-datasheet-136395376.pdf?src-supplier=Toby+Electronics; ComponentLink7Description: https://datasheet.octopart.com:443/FTS-103-01-F-S-Samtec-datasheet-136395376.pdf?src-supplier=Toby+Electronics; ComponentLink8URL: https://datasheet.octopart.com:443/FTS-103-01-F-S-Samtec-datasheet-151470456.pdf?src-supplier=Sager+Electronics; ComponentLink8Description: https://datasheet.octopart.com:443/FTS-103-01-F-S-Samtec-datasheet-151470456.pdf?src-supplier=Sager+Electronics
J9 = TL1963A-33DCYR (2): 1.5-A, 20-V, low-dropout voltage regulator with reverse current & reverse voltage protection; Manufacturer: Texas Instruments; Manufacturer Lifecycle Status: ACTIVE; Accuracy: 3%; Dropout Voltage: 340mV; Input Bias Current: 1mA; Max Supply Voltage: 20V; Max Output current: 1.5A; Max Output Voltage: 3.3V; Min Current Limit: 1.6A; Min Input Voltage: 2.1V; Number of Outputs: 1; Output Type: Fixed; Polarity: Positive; Supplier: DigiKey; Supplier Part Number: 296-24897-2-ND; Manufacturer Part Number: TL1963A-33DCYR; RoHS: Compliant; Category: LDO Voltage Regulators; Stock: 9352; Pricing: 2500=1.96374, 5000=1.9264 (USD); Case/Package: SOT-223; Contact Plating: Tin; Height: 1.8mm; Lead Free: Lead Free; Length: 6.5mm; Lifecycle Status: Production; Max Operating Temperature: 125°C; Min Operating Temperature: -40°C; Min Output Voltage: 3.3V; Nominal Output Voltage: 3.3V; Pins: 4; Number of Regulators: 1; Output Current: 1.5A; Output Voltage: 3.3V; Quiescent Current: 1mA; Radiation Hardening: No; REACH SVHC: No; Schedule B: 8542390000, 8542390000|8542390000|8542390000|8542390000|8542390000; Thickness: 1.6mm; Width: 3.5mm; ComponentLink1URL: https://datasheet.octopart.com:443/TL1963A-33DCYR-Texas-Instruments-datasheet-36835243.pdf?src-supplier=Texas+Instruments; ComponentLink1Description: https://datasheet.octopart.com:443/TL1963A-33DCYR-Texas-Instruments-datasheet-36835243.pdf?src-supplier=Texas+Instruments; ComponentLink2URL: https://octopart.com:443/opatz8j6/c1?t=T6L_nTitMyNJICCDbesyx6p8_62bCdqZ65S_Z96HuMIXQr7X1YC5sCYKc2G2sZmaKSzTD9pgjmwFXvZyRCcs-Ujiye_mHIO7XarW3zubqPSPpFC5Y6sXmp7ji2rmCsCeRCwBE76czpvbizj29Cxz0drVdDzGMAQ1c3ViNWnyv2jQOxF0qJUxdeVK-EpTX-NywrbSffrJtJOIeNfdNamOHw7Z4NXjvkScFAdPBIROiL9HxVs-b_-th4j6gHgcxnAFtu8UsijG5C9HKMp_DZeyZBevj8g9ql-tL9kNZQiuitw8iXc0YP7uoZ07alNDwNibYxWjFl1MxHNZnYTYABQMPMYSZ2mZceVkBAFerWOuRxAcoR_CV6VtDLLAwMwQpC0P_JBYQnM&src-supplier=Texas+Instruments; ComponentLink2Description: https://octopart.com:443/opatz8j6/c1?t=T6L_nTitMyNJICCDbesyx6p8_62bCdqZ65S_Z96HuMIXQr7X1YC5sCYKc2G2sZmaKSzTD9pgjmwFXvZyRCcs-Ujiye_mHIO7XarW3zubqPSPpFC5Y6sXmp7ji2rmCsCeRCwBE76czpvbizj29Cxz0drVdDzGMAQ1c3ViNWnyv2jQOxF0qJUxdeVK-EpTX-NywrbSffrJtJOIeNfdNamOHw7Z4NXjvkScFAdPBIROiL9HxVs-b_-th4j6gHgcxnAFtu8UsijG5C9HKMp_DZeyZBevj8g9ql-tL9kNZQiuitw8iXc0YP7uoZ07alNDwNibYxWjFl1MxHNZnYTYABQMPMYSZ2mZceVkBAFerWOuRxAcoR_CV6VtDLLAwMwQpC0P_JBYQnM&src-supplier=Texas+Instruments; ComponentLink3URL: https://datasheet.octopart.com:443/TL1963A-33DCYR-Texas-Instruments-datasheet-10255270.pdf?src-supplier=Texas+Instruments; ComponentLink3Description: https://datasheet.octopart.com:443/TL1963A-33DCYR-Texas-Instruments-datasheet-10255270.pdf?src-supplier=Texas+Instruments; ComponentLink4URL: https://sigma.octopart.com:443/49253063/technical_drawing/Texas-Instruments-TL1963A-33DCYR.pdf?src-supplier=Texas+Instruments; ComponentLink4Description: https://sigma.octopart.com:443/49253063/technical_drawing/Texas-Instruments-TL1963A-33DCYR.pdf?src-supplier=Texas+Instruments; ComponentLink5URL: https://datasheet.octopart.com:443/TL1963A-33DCYR-Texas-Instruments-datasheet-159117591.pdf?src-supplier=Augswan; ComponentLink5Description: https://datasheet.octopart.com:443/TL1963A-33DCYR-Texas-Instruments-datasheet-159117591.pdf?src-supplier=Augswan; ComponentLink6URL: https://datasheet.octopart.com:443/TL1963A-33DCYR-Texas-Instruments-datasheet-21820479.pdf?src-supplier=Newark; ComponentLink6Description: https://datasheet.octopart.com:443/TL1963A-33DCYR-Texas-Instruments-datasheet-21820479.pdf?src-supplier=Newark; ComponentLink7URL: https://datasheet.octopart.com:443/TL1963A-33DCYR-Texas-Instruments-datasheet-16079880.pdf?src-supplier=Farnell; ComponentLink7Description: https://datasheet.octopart.com:443/TL1963A-33DCYR-Texas-Instruments-datasheet-16079880.pdf?src-supplier=Farnell; ComponentLink8URL: https://datasheet.octopart.com:443/TL1963A-33DCYR-Texas-Instruments-datasheet-14171511.pdf?src-supplier=iiiC; ComponentLink8Description: https://datasheet.octopart.com:443/TL1963A-33DCYR-Texas-Instruments-datasheet-14171511.pdf?src-supplier=iiiC; ComponentLink9URL: http://sigma.octopart.com:80/reach_statement/Texas-Instruments-company-64.pdf?src-supplier=Compliance+Statements; ComponentLink9Description: http://sigma.octopart.com:80/reach_statement/Texas-Instruments-company-64.pdf?src-supplier=Compliance+Statements; ComponentLink10URL: http://sigma.octopart.com:80/conflict_mineral_statement/Texas-Instruments-company-63.pdf?src-supplier=Compliance+Statements; ComponentLink10Description: http://sigma.octopart.com:80/conflict_mineral_statement/Texas-Instruments-company-63.pdf?src-supplier=Compliance+Statements
J13 = FTS-103-01-F-DV-TR: Pin Header, Board-to-Board, Wire-to-Board, 3.4 A, 1.27 mm, 2 Rows, 6 Contacts, Surface Mount; Manufacturer: Samtec; Manufacturer Lifecycle Status: PRODUCTION; Current Rating: 3.4A; Gender: Male; Number of Contacts: 6; Pitch: 1.27mm; Supplier: DigiKey; Supplier Part Number: SAM14930DKR-ND; Manufacturer Part Number: FTS-103-01-F-DV-TR; RoHS: Compliant; Category: Board to Board Connectors; Stock: 10377; Pricing: 1=1.34, 10=1.14, 100=0.9687 (USD); Contact Material: Gold, Nickel; Contact Plating: Gold; Depth: 3.42mm; Height: 4.58mm; Housing Color: Black; Housing Material: Polymer; Length: 3.81mm; Lifecycle Status: Production; Max Operating Temperature: 125°C; Min Operating Temperature: -55°C; Number of Rows: 2; Orientation: Straight; Radiation Hardening: No; REACH SVHC: No; Schedule B: 8536694040, 8536694040|8536694040|8536694040|8536694040|8536694040; Termination: Solder; ComponentLink1URL: https://sigma.octopart.com:443/149591664/technical_drawing/Samtec-FTS-103-01-F-DV-TR.pdf?src-supplier=Upverter; ComponentLink1Description: https://sigma.octopart.com:443/149591664/technical_drawing/Samtec-FTS-103-01-F-DV-TR.pdf?src-supplier=Upverter; ComponentLink2URL: https://datasheet.octopart.com:443/FTS-103-01-F-DV-TR-Samtec-datasheet-97029283.pdf?src-supplier=Samtec; ComponentLink2Description: https://datasheet.octopart.com:443/FTS-103-01-F-DV-TR-Samtec-datasheet-97029283.pdf?src-supplier=Samtec; ComponentLink3URL: https://sigma.octopart.com:443/97029284/technical_drawing/Samtec-FTS-103-01-F-DV-TR.pdf?src-supplier=Samtec; ComponentLink3Description: https://sigma.octopart.com:443/97029284/technical_drawing/Samtec-FTS-103-01-F-DV-TR.pdf?src-supplier=Samtec; ComponentLink4URL: https://datasheet.octopart.com:443/FTS-103-01-F-DV-TR-Samtec-datasheet-118493358.pdf?src-supplier=Electro+Sonic; ComponentLink4Description: https://datasheet.octopart.com:443/FTS-103-01-F-DV-TR-Samtec-datasheet-118493358.pdf?src-supplier=Electro+Sonic; ComponentLink5URL: https://datasheet.octopart.com:443/FTS-103-01-F-DV-TR-Samtec-datasheet-38942038.pdf?src-supplier=Newark; ComponentLink5Description: https://datasheet.octopart.com:443/FTS-103-01-F-DV-TR-Samtec-datasheet-38942038.pdf?src-supplier=Newark; ComponentLink6URL: https://datasheet.octopart.com:443/FTS-103-01-F-DV-TR-Samtec-datasheet-62107111.pdf?src-supplier=Newark; ComponentLink6Description: https://datasheet.octopart.com:443/FTS-103-01-F-DV-TR-Samtec-datasheet-62107111.pdf?src-supplier=Newark; ComponentLink7URL: https://datasheet.octopart.com:443/FTS-103-01-F-DV-TR-Samtec-datasheet-24969243.pdf?src-supplier=Newark; ComponentLink7Description: https://datasheet.octopart.com:443/FTS-103-01-F-DV-TR-Samtec-datasheet-24969243.pdf?src-supplier=Newark; ComponentLink8URL: https://datasheet.octopart.com:443/FTS-103-01-F-DV-TR-Samtec-datasheet-165596534.pdf?src-supplier=JRH+Electronics; ComponentLink8Description: https://datasheet.octopart.com:443/FTS-103-01-F-DV-TR-Samtec-datasheet-165596534.pdf?src-supplier=JRH+Electronics; ComponentLink9URL: https://datasheet.octopart.com:443/FTS-103-01-F-DV-TR-Samtec-datasheet-176663378.pdf?src-supplier=Toby+Electronics; ComponentLink9Description: https://datasheet.octopart.com:443/FTS-103-01-F-DV-TR-Samtec-datasheet-176663378.pdf?src-supplier=Toby+Electronics; ComponentLink10URL: https://datasheet.octopart.com:443/FTS-103-01-F-DV-TR-Samtec-datasheet-116535195.pdf?src-supplier=Toby+Electronics; ComponentLink10Description: https://datasheet.octopart.com:443/FTS-103-01-F-DV-TR-Samtec-datasheet-116535195.pdf?src-supplier=Toby+Electronics; ComponentLink11URL: https://datasheet.octopart.com:443/FTS-103-01-F-DV-TR-Samtec-datasheet-136395376.pdf?src-supplier=Toby+Electronics; ComponentLink11Description: https://datasheet.octopart.com:443/FTS-103-01-F-DV-TR-Samtec-datasheet-136395376.pdf?src-supplier=Toby+Electronics; ComponentLink12URL: https://datasheet.octopart.com:443/FTS-103-01-F-DV-TR-Samtec-datasheet-151470456.pdf?src-supplier=Sager+Electronics; ComponentLink12Description: https://datasheet.octopart.com:443/FTS-103-01-F-DV-TR-Samtec-datasheet-151470456.pdf?src-supplier=Sager+Electronics; ComponentLink13URL: https://datasheet.octopart.com:443/FTS-103-01-F-DV-TR-Samtec-datasheet-140570650.pdf?src-supplier=Arrow.cn; ComponentLink13Description: https://datasheet.octopart.com:443/FTS-103-01-F-DV-TR-Samtec-datasheet-140570650.pdf?src-supplier=Arrow.cn